# Altium schematic sheet ESP32-WROOM32D_Module.SchDoc: ESP32-WROOM32D Module
size A4
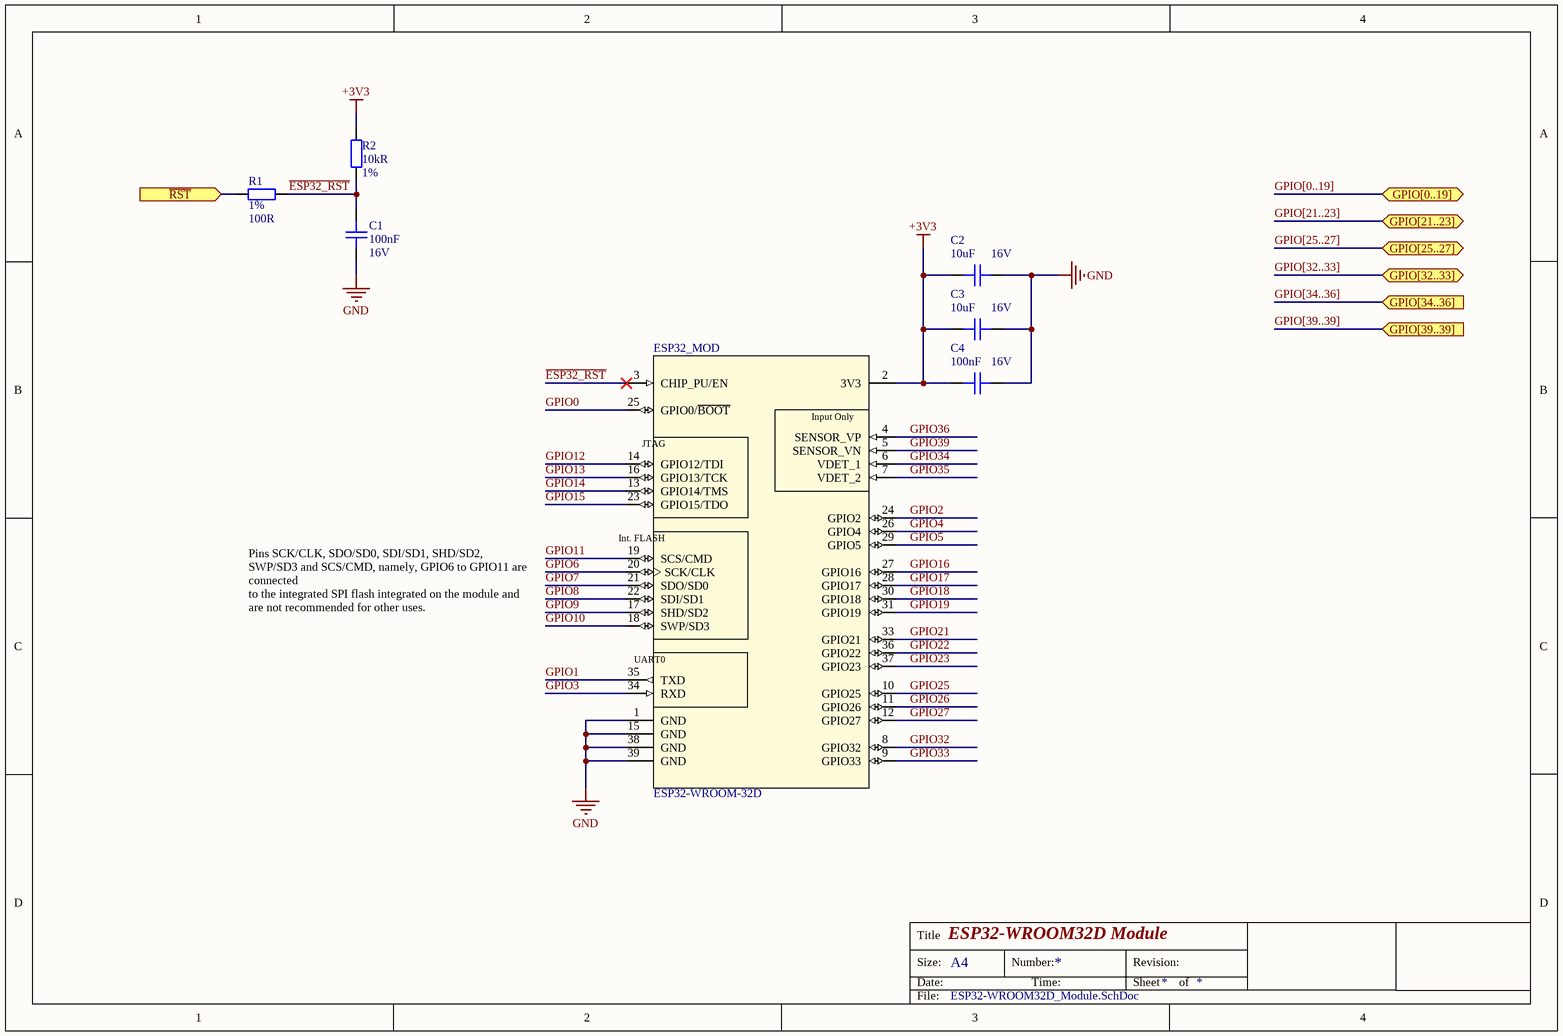
[diagram p0: ESP32-WROOM32D_Module.SchDoc]

## Parts
C1  Capacitance: 100nF  Voltage: 16V  [C0402]  (hidden comment: CAP CER 0.1UF 16V X7R 0402)
C2  Capacitance: 10uF  Voltage Rating: 16V  [C0603]  (hidden comment: CAP CER 10UF 16V X5R 0603)
C3  Capacitance: 10uF  Voltage Rating: 16V  [C0603]  (hidden comment: CAP CER 10UF 16V X5R 0603)
C4  Capacitance: 100nF  Voltage: 16V  [C0402]  (hidden comment: CAP CER 0.1UF 16V X7R 0402)
ESP32_MOD  ESP32-WROOM-32D  [MODULE_ESP32-WROOM-32D]
R1  Tolerance: 1%  Resistance: 100R  [R0402]  (hidden comment: RES SMD 100 OHM 1% 1/16W 0402)
R2  Resistance: 10kR  Tolerance: 1%  [R0402]  (hidden comment: RES SMD 10K OHM 1% 1/16W 0402)

## Ports
GPIO[0..19], GPIO[21..23], GPIO[25..27], GPIO[32..33], GPIO[34..36] (in), GPIO[39..39] (in), ~{RST} (in)

## Nets
+3V3: C2.2 C3.2 C4.2 ESP32_MOD.2(3V3) R2.1
GND: C1.1 C2.1 C3.1 C4.1 ESP32_MOD.1(GND) ESP32_MOD.15(GND) ESP32_MOD.38(GND) ESP32_MOD.39(GND)
~{ESP32_RST}: C1.2 ESP32_MOD.3(CHIP_PU/EN) R1.1 R2.2
~{RST}: R1.2 ; port ~{RST}
GPIO0: ESP32_MOD.25(GPIO0/~{BOOT})
GPIO1: ESP32_MOD.35(TXD)
GPIO2: ESP32_MOD.24(GPIO2)
GPIO3: ESP32_MOD.34(RXD)
GPIO4: ESP32_MOD.26(GPIO4)
GPIO5: ESP32_MOD.29(GPIO5)
GPIO6: ESP32_MOD.20(SCK/CLK)
GPIO7: ESP32_MOD.21(SDO/SD0)
GPIO8: ESP32_MOD.22(SDI/SD1)
GPIO9: ESP32_MOD.17(SHD/SD2)
GPIO10: ESP32_MOD.18(SWP/SD3)
GPIO11: ESP32_MOD.19(SCS/CMD)
GPIO12: ESP32_MOD.14(GPIO12/TDI)
GPIO13: ESP32_MOD.16(GPIO13/TCK)
GPIO14: ESP32_MOD.13(GPIO14/TMS)
GPIO15: ESP32_MOD.23(GPIO15/TDO)
GPIO16: ESP32_MOD.27(GPIO16)
GPIO17: ESP32_MOD.28(GPIO17)
GPIO18: ESP32_MOD.30(GPIO18)
GPIO19: ESP32_MOD.31(GPIO19)
GPIO21: ESP32_MOD.33(GPIO21)
GPIO22: ESP32_MOD.36(GPIO22)
GPIO23: ESP32_MOD.37(GPIO23)
GPIO25: ESP32_MOD.10(GPIO25)
GPIO26: ESP32_MOD.11(GPIO26)
GPIO27: ESP32_MOD.12(GPIO27)
GPIO32: ESP32_MOD.8(GPIO32)
GPIO33: ESP32_MOD.9(GPIO33)
GPIO34: ESP32_MOD.6(VDET_1)
GPIO35: ESP32_MOD.7(VDET_2)
GPIO36: ESP32_MOD.4(SENSOR_VP)
GPIO39: ESP32_MOD.5(SENSOR_VN)

## Buses and harness runs
bus GPIO[0..19] = port GPIO[0..19]
bus GPIO[21..23] = port GPIO[21..23]
bus GPIO[25..27] = port GPIO[25..27]
bus GPIO[32..33] = port GPIO[32..33]
bus GPIO[34..36] = port GPIO[34..36]
bus GPIO[39..39] = port GPIO[39..39]

## Notes on the sheet
- Pins SCK/CLK, SDO/SD0, SDI/SD1, SHD/SD2, SWP/SD3 and SCS/CMD, namely, GPIO6 to GPIO11 are connected
  to the integrated SPI flash integrated on the module and are not recommended for other uses.
- Title
- Size:
- Date:
- A4
- Number:
- Time:
- Revision:
- Sheet
- of
- File:
- (in symbol MOD ESP32-WROOM-32D TRACE ANT SMD) Input Only; JTAG; Int. FLASH; UART0

## Library data of the parts
C1 C4 = CAP CER 0.1UF 16V X7R 0402: 0.1µF ±10% 16V Ceramic Capacitor X7R 0402 (1005 Metric); Manufacturer Part Number: CC0402KRX7R7BB104; Manufacturer: Yageo; Revision: July-2002: Re-released for DXP Platform.; Order: CC0402KRX7R7BB104; Supplier 1: Digi-Key; Stock 1: 25916830; Pricing 1: 1=0.1, 10=0.031, 100=0.0136, 500=0.0097, 1000=0.0077, 2500=0.007, 5000=0.0064 (USD); Mount: Surface Mount; Number of Pins: 2; Case Code (Metric): 1005; Case Code (Imperial): 0402; Min Operating Temperature: -55°C; Max Operating Temperature: 125°C; Tolerance: 10%; Dielectric: X7R; Voltage Rating: 16V; Voltage Rating (DC): 16V; Packaging: Tape and Reel; Package Quantity: 1; Termination: SMD/SMT; Composition: Ceramic; Length: 1mm; Height: 0.5mm; Width: 0.02inch; Thickness: 0.022inch; Depth: 0.5mm; Radiation Hardening: No; REACH SVHC: No SVHC; Lead Free: Lead Free; Halogen Free: Halogen Free; ComponentLink1URL: http://www.yageo.com/documents/recent/UPY-GPHC_X7R_6.3V-to-50V_8.pdf?src-supplier=Avnet+Europe; ComponentLink1Description: http://www.yageo.com/documents/recent/UPY-GPHC_X7R_6.3V-to-50V_8.pdf?src-supplier=Avnet+Europe; ComponentLink2URL: http://www.yageo.com/documents/recent/UPY-GPHC_X7R_6.3V-to-50V_18.pdf?src-supplier=Digi-Key; ComponentLink2Description: http://www.yageo.com/documents/recent/UPY-GPHC_X7R_6.3V-to-50V_18.pdf?src-supplier=Digi-Key; ComponentLink3URL: http://www.yageo.com/documents/recent/UPY-GPHC_X7R_6.3V-to-50V_8.pdf?src-supplier=Avnet; ComponentLink3Description: http://www.yageo.com/documents/recent/UPY-GPHC_X7R_6.3V-to-50V_8.pdf?src-supplier=Avnet; ComponentLink4URL: http://www.yageo.com/documents/recent/UPY-GPHC_X7R_6.3V-to-50V_18.pdf?src-supplier=Mouser; ComponentLink4Description: http://www.yageo.com/documents/recent/UPY-GPHC_X7R_6.3V-to-50V_18.pdf?src-supplier=Mouser; ComponentLink5URL: http://www.farnell.com/datasheets/2167236.pdf?src-supplier=Element14; ComponentLink5Description: http://www.farnell.com/datasheets/2167236.pdf?src-supplier=Element14; ComponentLink6URL: http://www.farnell.com/datasheets/1489800.pdf?src-supplier=Element14; ComponentLink6Description: http://www.farnell.com/datasheets/1489800.pdf?src-supplier=Element14; Supplier Part Number 1: 311-1338-1-ND
C2 C3 = CAP CER 10UF 16V X5R 0603: 10µF ±10% 16V Ceramic Capacitor X5R 0603 (1608 Metric); Manufacturer: Murata; Manufacturer Part Number: GRM188R61C106KAALJ; Supplier 1: Digi-Key; Stock 1: 5470; Pricing 1: 1=0.39, 10=0.271, 100=0.1628, 500=0.1221, 1000=0.1031, 2500=0.0977, 5000=0.0923 (USD); Mount: Surface Mount; Case/Package: 0603; Case Code (Imperial): 0603; Case Code (Metric): 1608; Min Operating Temperature: -55°C; Max Operating Temperature: 85°C; Tolerance: 10%; Dielectric: X5R; Voltage Rating (DC): 16V; Packaging: Tape and Reel; Package Quantity: 10000; Termination: SMD/SMT; Length: 0.063inch; Height: 0.8mm; Width: 0.031inch; Thickness: 0.037inch; Supplier Part Number 1: 490-12736-1-ND; Weight: 0.000222oz; Composition: Ceramic
ESP32_MOD = MOD ESP32-WROOM-32D TRACE ANT SMD: Bluetooth, WiFi 802.11b/g/n, Bluetooth v4.2 + EDR, Class 1, 2 and 3 Transceiver Module 2.4GHz ~ 2.5GHz Integrated, Trace Surface Mount; Manufacturer: Espressif Systems; Interface: I2C,SPI,GPIO,PWM,SDIO,UART; Data Rate: 150Mbps; Sensitivity: -98dBm; Memory Size: 536KB; Case/Package: SMD/SMT; Supplier 1: Digi-Key; Manufacturer Part Number: ESP32-WROOM-32D; Stock 1: 11163; Pricing 1: 1=3.8 (USD); Mount: Surface Mount; Min Operating Temperature: -40°C; Max Operating Temperature: 85°C; Packaging: Cut Tape; Frequency: 2.5GHz; ComponentLink1URL: https://www.espressif.com/sites/default/files/documentation/esp32-wroom-32d_esp32-wroom-32u_datasheet_en.pdf?src-supplier=Digi-Key; ComponentLink1Description: https://www.espressif.com/sites/default/files/documentation/esp32-wroom-32d_esp32-wroom-32u_datasheet_en.pdf?src-supplier=Digi-Key; Supplier Part Number 1: 1904-1023-1-ND
R1 = RES SMD 100 OHM 1% 1/16W 0402: 100 Ohms ±1% 0.063W, 1/16W Chip Resistor 0402 (1005 Metric) Moisture Resistant Thick Film; Manufacturer Part Number: RC0402FR-07100RL; Manufacturer: Yageo; Power Rating: 62.5mW; Voltage Rating: 50V; Temperature Coefficient: 100ppm/°C; Supplier 1: Digi-Key; Stock 1: 16989760; Pricing 1: 1=0.1, 10=0.016, 100=0.0064, 1000=0.0029, 2500=0.0025, 5000=0.0021 (USD); Case/Package: 0402; Number of Pins: 2; Case Code (Imperial): 0402; Case Code (Metric): 1005; Min Operating Temperature: -55°C; Max Operating Temperature: 155°C; Voltage Rating (DC): 50V; Packaging: Tape and Reel; Termination: SMD/SMT; Composition: Thick Film; Military Standard: Not; Length: 1mm; Height: 0.32mm; Width: 0.5mm; Depth: 0.5mm; REACH SVHC: No SVHC; Lead Free: Lead Free; ComponentLink1URL: http://www.farnell.com/datasheets/2167052.pdf?src-supplier=Element14; ComponentLink1Description: http://www.farnell.com/datasheets/2167052.pdf?src-supplier=Element14; ComponentLink2URL: http://www.yageo.com/documents/recent/PYu-RC_Group_51_RoHS_L_9.pdf?src-supplier=Mouser; ComponentLink2Description: http://www.yageo.com/documents/recent/PYu-RC_Group_51_RoHS_L_9.pdf?src-supplier=Mouser; ComponentLink3URL: http://www.yageo.com/documents/recent/PYu-RC0402_51_RoHS_L_6_r.pdf?src-supplier=Future+Electronics; ComponentLink3Description: http://www.yageo.com/documents/recent/PYu-RC0402_51_RoHS_L_6_r.pdf?src-supplier=Future+Electronics; ComponentLink4URL: https://www.verical.com/server-webapp/html/getDatasheet?partID=329466&src-supplier=Verical; ComponentLink4Description: https://www.verical.com/server-webapp/html/getDatasheet?partID=329466&src-supplier=Verical; ComponentLink5URL: http://www.farnell.com/datasheets/1018594.pdf?src-supplier=Element14; ComponentLink5Description: http://www.farnell.com/datasheets/1018594.pdf?src-supplier=Element14; ComponentLink6URL: http://documents.rs-components.com/techlib://itc_doclist_GB.htm?stockno=6185810&src-supplier=RSComponents; ComponentLink6Description: http://documents.rs-components.com/techlib://itc_doclist_GB.htm?stockno=6185810&src-supplier=RSComponents; Supplier Part Number 1: 311-100LRDKR-ND; Mount: Surface Mount
R2 = RES SMD 10K OHM 1% 1/16W 0402: 10 kOhms ±1% 0.063W, 1/16W Chip Resistor 0402 (1005 Metric) Moisture Resistant Thick Film; Manufacturer Part Number: RC0402FR-0710KP; Manufacturer: Yageo; Temperature Coefficient: 150ppm/°C; Max Power Dissipation: 63mW; Supplier 1: Digi-Key; Stock 1: 839368; Pricing 1: 1=0.1, 10=0.035, 100=0.014, 1000=0.0063, 2500=0.0055, 5000=0.0045 (USD); Case Code (Imperial): 0402; Case Code (Metric): 1005; Min Operating Temperature: -55°C; Max Operating Temperature: 155°C; Composition: Thick Film; Packaging: Tape and Reel; Number of Terminations: 2; Length: 0.039inch; Height: 0.016inch; Width: 0.02inch; ComponentLink1URL: http://www.yageo.com/NewPortal/yageodocoutput?fileName=/pdf/R-Chip/PYu-RC_51_RoHS_P_0.pdf&src-supplier=Digi-Key; ComponentLink1Description: http://www.yageo.com/NewPortal/yageodocoutput?fileName=/pdf/R-Chip/PYu-RC_51_RoHS_P_0.pdf&src-supplier=Digi-Key; Supplier Part Number 1: YAG1249CT-ND; Case/Package: 0402; Features: Moisture Resistant; Mount: Surface Mount